# Altium schematic sheet Connect.SchDoc
size A4; SheetNumber: 3; SheetTotal: 6
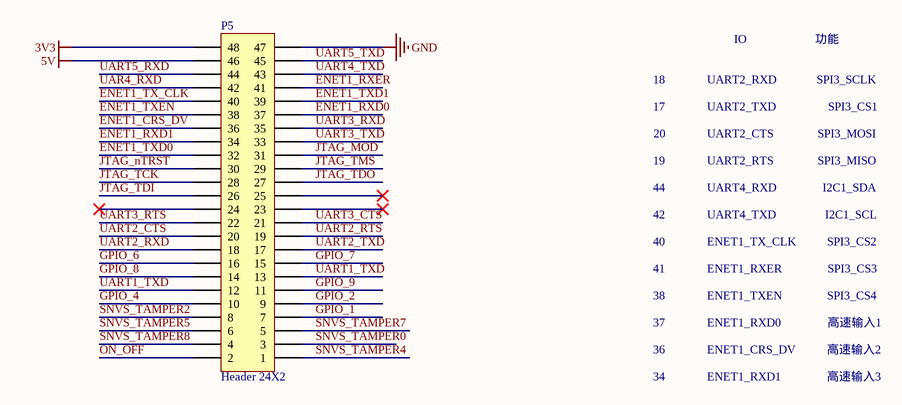
[diagram p0: Connect.SchDoc]

## Parts
P5  Header 24X2  [HDR2X24]

## Nets
3V3: P5.48
5V: P5.46
GND: P5.47
ENET1_CRS_DV: P5.36
ENET1_RXD0: P5.37
ENET1_RXD1: P5.34
ENET1_RXER: P5.41
ENET1_TX_CLK: P5.40
ENET1_TXD0: P5.32
ENET1_TXD1: P5.39
ENET1_TXEN: P5.38
GPIO_1: P5.7
GPIO_2: P5.9
GPIO_4: P5.10
GPIO_6: P5.16
GPIO_7: P5.15
GPIO_8: P5.14
GPIO_9: P5.11
JTAG_MOD: P5.31
JTAG_nTRST: P5.30
JTAG_TCK: P5.28
JTAG_TDI: P5.26
JTAG_TDO: P5.27
JTAG_TMS: P5.29
ON_OFF: P5.2
SNVS_TAMPER0: P5.3
SNVS_TAMPER2: P5.8
SNVS_TAMPER4: P5.1
SNVS_TAMPER5: P5.6
SNVS_TAMPER7: P5.5
SNVS_TAMPER8: P5.4
UAR4_RXD: P5.42
UART1_TXD: P5.12 P5.13
UART2_CTS: P5.20
UART2_RTS: P5.19
UART2_RXD: P5.18
UART2_TXD: P5.17
UART3_CTS: P5.21
UART3_RTS: P5.22
UART3_RXD: P5.35
UART3_TXD: P5.33
UART4_TXD: P5.43
UART5_RXD: P5.44
UART5_TXD: P5.45

Not connected (* = marked no-connect by the designer): P5 23* 24* 25*

## Notes on the sheet
- 18
- UART2_RXD
- IO
- 功能
- SPI3_SCLK
- 17
- 20
- UART2_TXD
- UART2_CTS
- SPI3_MOSI
- SPI3_CS1
- 44
- 19
- 42
- UART2_RTS
- UART4_RXD
- UART4_TXD
- SPI3_MISO
- I2C1_SDA
- I2C1_SCL
- 40
- 41
- ENET1_TX_CLK
- ENET1_RXER
- SPI3_CS2
- SPI3_CS3
- 38
- 37
- 36
- ENET1_TXEN
- ENET1_RXD0
- ENET1_CRS_DV
- SPI3_CS4
- 高速输入2
- 高速输入1
- 34
- ENET1_RXD1
- 高速输入3

## Library data of the parts
P5 = Header 24X2: Header, 24-Pin, Dual row; LatestRevisionDate: 17-Jul-2002; LatestRevisionNote: Re-released for DXP Platform.; Publisher: Altium Limited